# Altium schematic sheet Clocks.SchDoc
size A
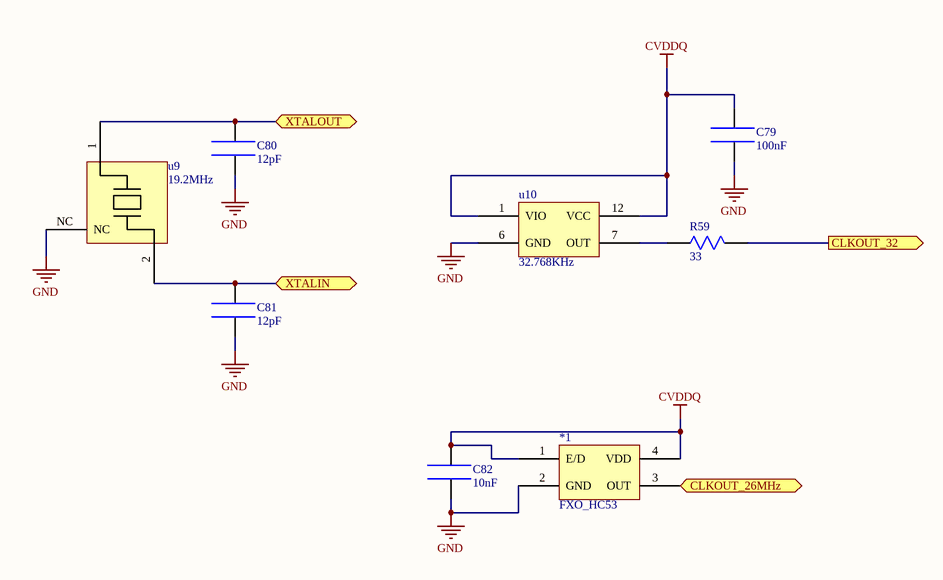
[diagram p0: Clocks.SchDoc]

## Parts
*1  FXO_HC53  [FXO_HC53]
C79  value 100nF  [SMD Capacitor 0603]  (hidden comment: Capacitor)
C80  value 12pF  [SMD Capacitor 0603]  (hidden comment: Capacitor)
C81  value 12pF  [SMD Capacitor 0603]  (hidden comment: Capacitor)
C82  value 10nF  [SMD Capacitor 0603]  (hidden comment: Capacitor)
R59  value 33  [SMD Resistor 0603]  (hidden comment: Resistor)
u9  Freq: 19.2MHz  [NX3225SA]  (hidden comment: CrystalOSC_General)
u10  Freq: 32.768KHz  [SG-3040LC]  (hidden comment: SG-3040LC)

## Ports
CLKOUT_26MHz (out), CLKOUT_32 (out), XTALIN, XTALOUT

## Nets
CVDDQ: *1.1(E/D) *1.4(VDD) C79.1 C82.1 u10.1(VIO) u10.12(VCC)
GND: *1.2(GND) C79.0 C80.0 C81.0 C82.0 u9.NC u10.6(GND)
CLKOUT_26MHz: *1.3(OUT) ; port CLKOUT_26MHz
CLKOUT_32: R59.1 ; port CLKOUT_32
XTALIN: C81.1 u9.2 ; port XTALIN
XTALOUT: C80.1 u9.1 ; port XTALOUT
NetR59_0: R59.0 u10.7(OUT)